# EAGLE design VC Panning Mixer main (EAGLE 7.7.0)
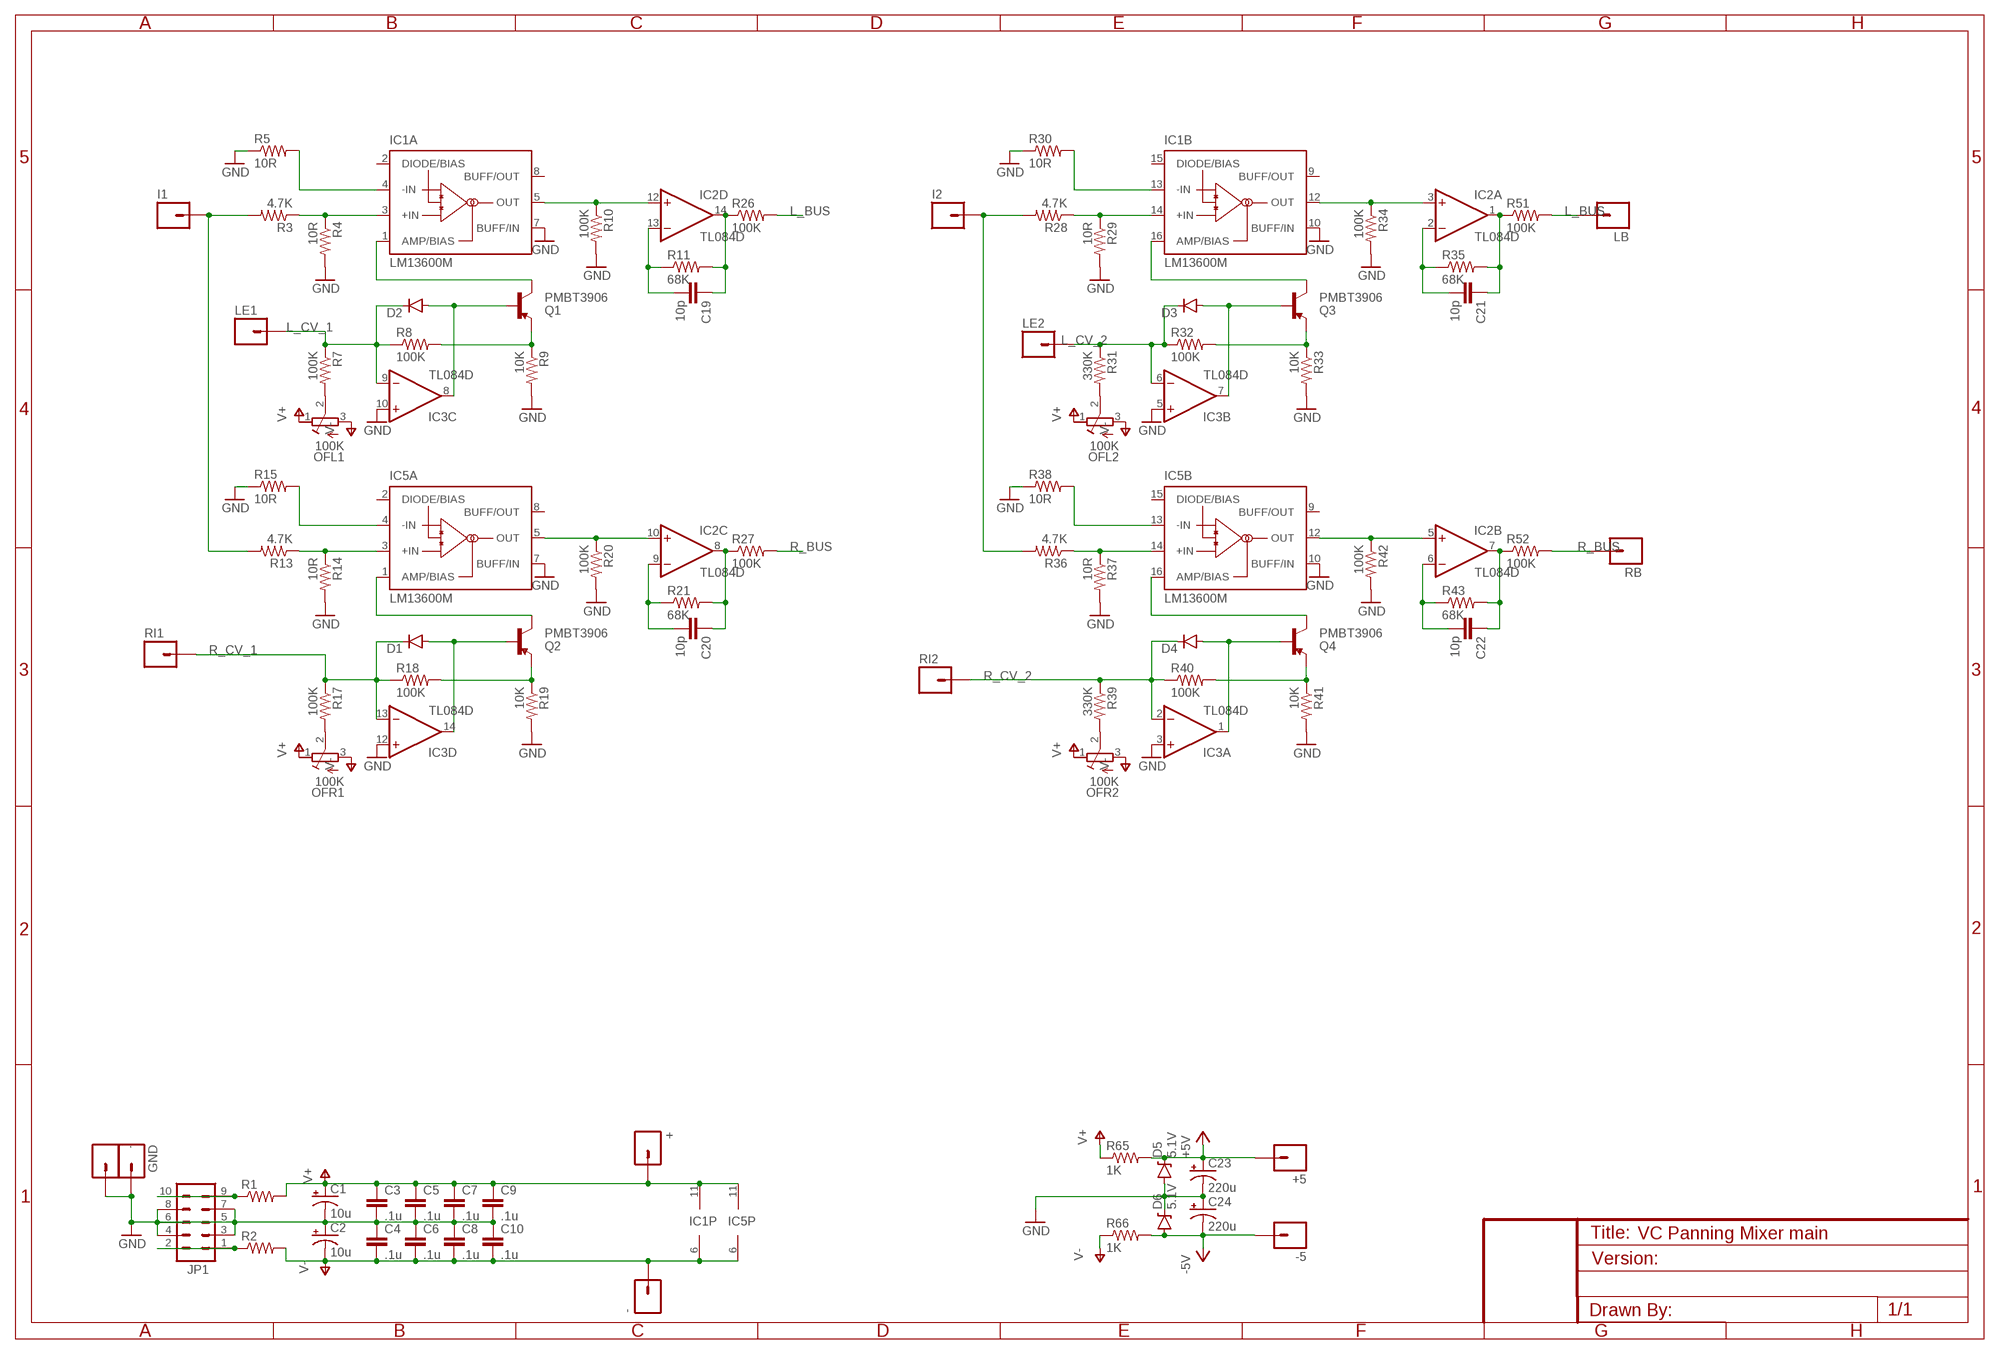
[diagram p0: schematic, sheet 1]

## Parts
+  M01PTH  [1X01]
+5  M01PTH  [1X01]
-  M01PTH  [1X01]
-5  M01PTH  [1X01]
.  M01PTH  [1X01]
C1  10u  CAP_POLPTH2  [CPOL-RADIAL-10UF-25V]
C2  10u  CAP_POLPTH2  [CPOL-RADIAL-10UF-25V]
C3  .1u  CAP0805  [0805]
C4  .1u  CAP0805  [0805]
C5  .1u  CAP0805  [0805]
C6  .1u  CAP0805  [0805]
C7  .1u  CAP0805  [0805]
C8  .1u  CAP0805  [0805]
C9  .1u  CAP0805  [0805]
C10  .1u  CAP0805  [0805]
C19  10p  CAP0805  [0805]
C20  10p  CAP0805  [0805]
C21  10p  CAP0805  [0805]
C22  10p  CAP0805  [0805]
C23  220u  CAP_POLPTH2  [CPOL-RADIAL-10UF-25V]
C24  220u  CAP_POLPTH2  [CPOL-RADIAL-10UF-25V]
D1  DIODESOD123  [SOD-123]
D2  DIODESOD123  [SOD-123]
D3  DIODESOD123  [SOD-123]
D4  DIODESOD123  [SOD-123]
D5  5.1V  DIODE-ZENER16V  [SOD-123]
D6  5.1V  DIODE-ZENER16V  [SOD-123]
GND  M01PTH  [1X01]
I1  M01PTH  [1X01]
I2  M01PTH  [1X01]
IC1  LM13600M  [SO16]
IC2  TL084D  [SO14]
IC3  TL084D  [SO14]
IC5  LM13600M  [SO16]
JP1  M05X2PTH  [AVR_ICSP]
LB  M01PTH  [1X01]
LE1  M01PTH  [1X01]
LE2  M01PTH  [1X01]
OFL1  100K  R-TRIMM3314G  [RTRIM3314G]
OFL2  100K  R-TRIMM3314G  [RTRIM3314G]
OFR1  100K  R-TRIMM3314G  [RTRIM3314G]
OFR2  100K  R-TRIMM3314G  [RTRIM3314G]
Q1  PMBT3906  TRANSISTOR_PNPPMBT3906  [SOT23-3]
Q2  PMBT3906  TRANSISTOR_PNPPMBT3906  [SOT23-3]
Q3  PMBT3906  TRANSISTOR_PNPPMBT3906  [SOT23-3]
Q4  PMBT3906  TRANSISTOR_PNPPMBT3906  [SOT23-3]
R1  RESISTOR0805-RES  [0805@1]
R2  RESISTOR0805-RES  [0805@1]
R3  4.7K  RESISTOR0805-RES  [0805]
R4  10R  RESISTOR0805-RES  [0805]
R5  10R  RESISTOR0805-RES  [0805]
R7  100K  RESISTOR0805-RES  [0805]
R8  100K  RESISTOR0805-RES  [0805]
R9  10K  RESISTOR0805-RES  [0805]
R10  100K  RESISTOR0805-RES  [0805]
R11  68K  RESISTOR0805-RES  [0805]
R13  4.7K  RESISTOR0805-RES  [0805]
R14  10R  RESISTOR0805-RES  [0805]
R15  10R  RESISTOR0805-RES  [0805]
R17  100K  RESISTOR0805-RES  [0805]
R18  100K  RESISTOR0805-RES  [0805]
R19  10K  RESISTOR0805-RES  [0805]
R20  100K  RESISTOR0805-RES  [0805]
R21  68K  RESISTOR0805-RES  [0805]
R26  100K  RESISTOR0805-RES  [0805]
R27  100K  RESISTOR0805-RES  [0805]
R28  4.7K  RESISTOR0805-RES  [0805]
R29  10R  RESISTOR0805-RES  [0805]
R30  10R  RESISTOR0805-RES  [0805]
R31  330K  RESISTOR0805-RES  [0805]
R32  100K  RESISTOR0805-RES  [0805]
R33  10K  RESISTOR0805-RES  [0805]
R34  100K  RESISTOR0805-RES  [0805]
R35  68K  RESISTOR0805-RES  [0805]
R36  4.7K  RESISTOR0805-RES  [0805]
R37  10R  RESISTOR0805-RES  [0805]
R38  10R  RESISTOR0805-RES  [0805]
R39  330K  RESISTOR0805-RES  [0805]
R40  100K  RESISTOR0805-RES  [0805]
R41  10K  RESISTOR0805-RES  [0805]
R42  100K  RESISTOR0805-RES  [0805]
R43  68K  RESISTOR0805-RES  [0805]
R51  100K  RESISTOR0805-RES  [0805]
R52  100K  RESISTOR0805-RES  [0805]
R65  1K  RESISTOR0805-RES  [0805]
R66  1K  RESISTOR0805-RES  [0805]
RB  M01PTH  [1X01]
RI1  M01PTH  [1X01]
RI2  M01PTH  [1X01]

## Nets
+5V: +5.1 C23.1(+) D5.C R65.2
-5V: -5.1 C24.2(-) D6.A R66.2
GND: ..1 C1.2(-) C2.1(+) C3.2 C4.1 C5.2 C6.1 C7.2 C8.1 C9.2 C10.1 C23.2(-) C24.1(+) D5.A D6.C GND.1 IC1.7(A:BUFF/IN) IC1.10(B:BUFF/IN) IC3.3(A:+IN) IC3.5(B:+IN) IC3.10(C:+IN) IC3.12(D:+IN) IC5.7(A:BUFF/IN) IC5.10(B:BUFF/IN) JP1.3 JP1.4 JP1.5 JP1.6 JP1.7 JP1.8 R4.2 R5.1 R9.2 R10.2 R14.2 R15.1 R19.2 R20.2 R29.2 R30.1 R33.2 R34.2 R37.2 R38.1 R41.2 R42.2
L_BUS: LB.1 R26.2 R51.2
L_CV_1: D2.C IC3.9(C:-IN) LE1.1 R7.1 R8.1
L_CV_2: D3.C IC3.6(B:-IN) LE2.1 R31.1 R32.1
N$1: JP1.9 JP1.10 R1.1
N$2: JP1.1 JP1.2 R2.1
N$3: I1.1 R3.2 R13.2
N$4: IC5.3(A:+IN) R13.1 R14.1
N$5: IC5.4(A:-IN) R15.2
N$6: OFR1.2(S) R17.2
N$8: Q2.2(E) R18.2 R19.1
N$9: D1.A IC3.14(D:OUT) Q2.1(B)
N$10: IC5.1(A:AMP/BIAS) Q2.3(C)
N$12: IC1.3(A:+IN) R3.1 R4.1
N$13: IC2.10(C:+IN) IC5.5(A:OUT) R20.1
N$14: IC1.4(A:-IN) R5.2
N$15: OFL1.2(S) R7.2
N$17: Q1.2(E) R8.2 R9.1
N$18: D2.A IC3.8(C:OUT) Q1.1(B)
N$20: C20.2 IC2.9(C:-IN) R21.1
N$21: IC1.1(A:AMP/BIAS) Q1.3(C)
N$22: IC1.5(A:OUT) IC2.12(D:+IN) R10.1
N$23: C19.2 IC2.13(D:-IN) R11.1
N$24: C19.1 IC2.14(D:OUT) R11.2 R26.1
N$25: C20.1 IC2.8(C:OUT) R21.2 R27.1
N$36: IC1.14(B:+IN) R28.1 R29.1
N$37: IC1.13(B:-IN) R30.2
N$38: OFL2.2(S) R31.2
N$39: Q3.2(E) R32.2 R33.1
N$40: D3.A IC3.7(B:OUT) Q3.1(B)
N$41: IC1.16(B:AMP/BIAS) Q3.3(C)
N$42: IC1.12(B:OUT) IC2.3(A:+IN) R34.1
N$43: C21.2 IC2.2(A:-IN) R35.1
N$44: C21.1 IC2.1(A:OUT) R35.2 R51.1
N$45: I2.1 R28.2 R36.2
N$46: IC5.14(B:+IN) R36.1 R37.1
N$47: IC5.13(B:-IN) R38.2
N$48: OFR2.2(S) R39.2
N$49: Q4.2(E) R40.2 R41.1
N$50: D4.A IC3.1(A:OUT) Q4.1(B)
N$51: IC5.16(B:AMP/BIAS) Q4.3(C)
N$52: IC2.5(B:+IN) IC5.12(B:OUT) R42.1
N$53: C22.2 IC2.6(B:-IN) R43.1
N$54: C22.1 IC2.7(B:OUT) R43.2 R52.1
R_BUS: R27.2 R52.2 RB.1
R_CV_1: D1.C IC3.13(D:-IN) R17.1 R18.1 RI1.1
R_CV_2: D4.C IC3.2(A:-IN) R39.1 R40.1 RI2.1
V+: +.1 C1.1(+) C3.1 C5.1 C7.1 C9.1 IC1.11(P:V+) IC5.11(P:V+) OFL1.1(E) OFL2.1(E) OFR1.1(E) OFR2.1(E) R1.2 R65.1
V-: -.1 C2.2(-) C4.2 C6.2 C8.2 C10.2 IC1.6(P:V-) IC5.6(P:V-) OFL1.3(A) OFL2.3(A) OFR1.3(A) OFR2.3(A) R2.2 R66.1
Unconnected: IC1.2(A:DIODE/BIAS) IC1.8(A:BUFF/OUT) IC1.9(B:BUFF/OUT) IC1.15(B:DIODE/BIAS) IC5.2(A:DIODE/BIAS) IC5.8(A:BUFF/OUT) IC5.9(B:BUFF/OUT) IC5.15(B:DIODE/BIAS)

## Power pins joined to a net without a drawn wire
V+: IC2.4(P:V+) IC3.4(P:V+)
V-: IC2.11(P:V-) IC3.11(P:V-)

## Library data of the parts
+ +5 - -5 . GND I1 I2 LB LE1 LE2 RB RI1 RI2 = SparkFun-Connectors:M01: Header 1 Standard 1-pin 0.1" header. Use with straight break away headers (SKU : PRT-00116), right angle break away headers (PRT-00553), swiss pins (PRT-00743), machine pins (PRT-00117), and female headers (PRT-00115).
C1 C2 C23 C24 = SparkFun-Capacitors:CAP_POL: Capacitor Polarized These are standard SMD and PTH capacitors. Normally 10uF, 47uF, and 100uF in electrolytic and tantalum varieties. Always verify the external diameter of the through hole cap, it varies with capacity, voltage, and manufacturer. The EIA devices should be standard.
C3-C10 C19-C22 = SparkFun-Capacitors:CAP: Capacitor Standard 0603 ceramic capacitor, and 0.1" leaded capacitor.
D1-D4 = SparkFun-DiscreteSemi:DIODE: Diode These are standard reverse protection diodes and small signal diodes. SMA package can handle up to about 1A. SOD-323 can handle about 200mA. What the SOD-323 package when ordering, there are some mfgs out there that are 5-pin packages.
D5 D6 = SparkFun-DiscreteSemi:DIODE-ZENER: Zener Diode Production Part - 8199 3.4V Zener Voltage; PROD_ID: DIO-12440; VALUE: 16V
IC1 IC5 = national-semiconductor:LM13600: Dual Operational Transconductance Amplifiers with Linearizing Diodes and Buffers Source: lm13600.PDF
IC2 IC3 = linear:TL084: OP AMP
JP1 = SparkFun-Connectors:M05X2: Header 5x2 Standard 10-pin dual row 0.1" header. Commonly used with AVR-ISP. Use with Spark Fun Electronics SKU: PRT-00778
OFL1 OFL2 OFR1 OFR2 = rcl:R-TRIMM: Trimm resistor
Q1-Q4 = SparkFun-DiscreteSemi:TRANSISTOR_PNP: Generic PNP BJT Double check pinouts against datasheets- not all devices are the same! MMBT3906 - 40V 200mA SOT-23 (TRANS-08052) MMBT4403 - 40V 600mA SOT-23 (TRANS-09245); PROD_ID: TRANS-08052
R1 R2 = SparkFun-Passives:RESISTOR: Resistor Basic schematic elements and footprints for 0603, 1206, and PTH resistors.
R3-R5 R7-R11 R13-R15 R17-R21 R26-R43 R51 R52 R65 R66 = SparkFun-Resistors:RESISTOR: Resistor Basic schematic elements and footprints for 0603, 1206, and PTH resistors.

## Board
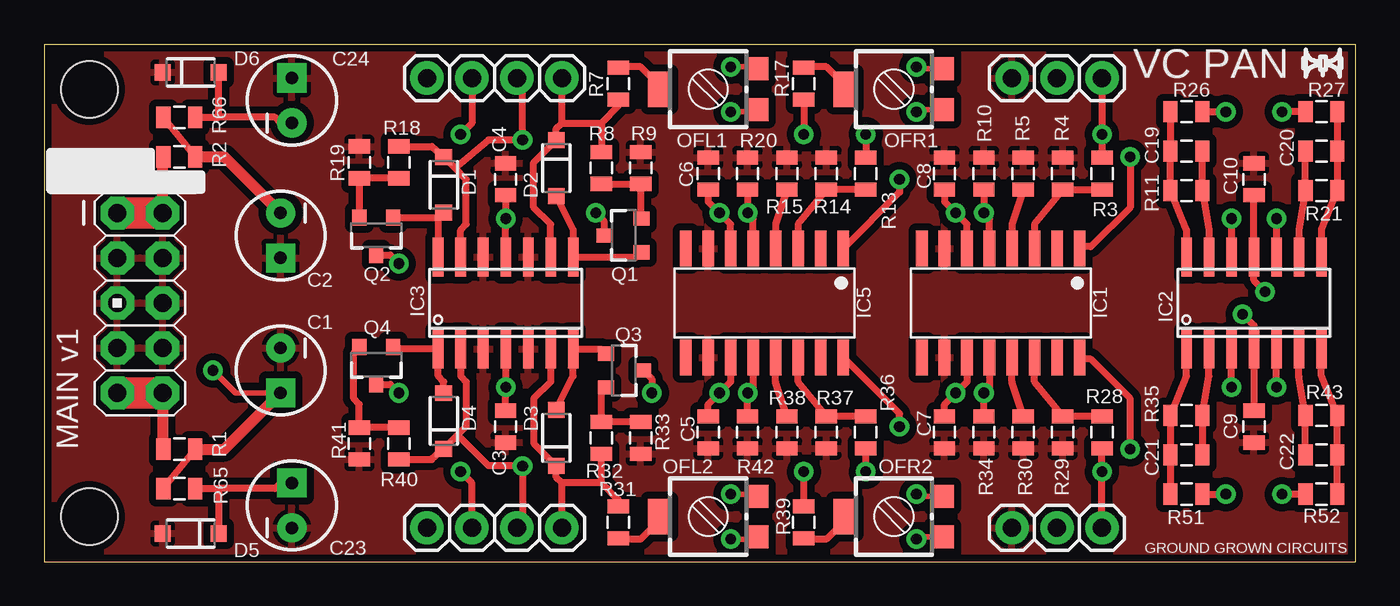
[diagram p1: board, top side]
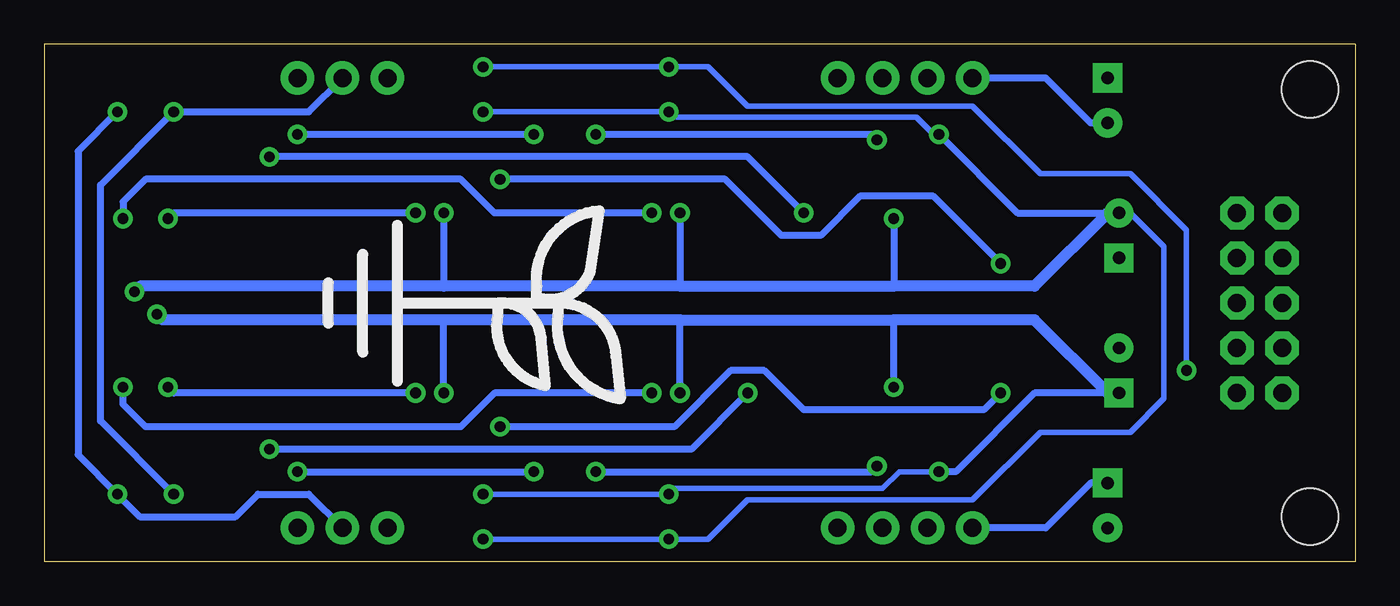
[diagram p2: board, bottom side, seen from below]

Size 73.98 x 29.21 mm. Coordinates in mm from the lower left corner, seen from the top.
Outline: 0,0 73.98,0 73.98,29.21 0,29.21 0,0
Copper layers (1*16): Top 0.035mm / dielectric 1.5mm / Bottom 0.035mm
Design rules "SparkFun": minimum track width 8mil, minimum drill 20mil, track to track 8mil, track to pad 8mil, pad to pad 8mil, via to via 8mil, smd to smd 8mil, copper to edge 8mil, drill to drill 8mil, minimum pad ring 12mil, minimum via ring 10mil, stop-mask expansion 4mil, vias tented up to drill 20mil, thermal gap 10mil
Holes 3.2 mm at 2.54,2.54 2.54,26.67

### Footprints (pad centres in the part's own frame; a part is rotated, then mirrored left to right if it is on the bottom)
1X01 = drill 1.016 pad 1.88: 1 0,0
CPOL-RADIAL-10UF-25V = drill 0.7 pad 1.651 square: 1 1.27,0 | drill 0.7 pad 1.651: 2 -1.27,0
0805 = smd 0.8 x 1.2: 1 -0.9,0; 2 0.9,0
SOD-123 = smd 0.9 x 0.95: A 1.575,0; C -1.575,0
SO16 = smd 0.66 x 2.032: 1 -4.445,-3.073; 2 -3.175,-3.073; 3 -1.905,-3.073; 4 -0.635,-3.073; 5 0.635,-3.073; 6 1.905,-3.073; 7 3.175,-3.073; 8 4.445,-3.073; 9 4.445,3.073; 10 3.175,3.073; 11 1.905,3.073; 12 0.635,3.073; 13 -0.635,3.073; 14 -1.905,3.073; 15 -3.175,3.073; 16 -4.445,3.073
SO14 = smd 0.6 x 2.2: 1 -3.81,-2.6; 2 -2.54,-2.6; 3 -1.27,-2.6; 4 0,-2.6; 5 1.27,-2.6; 6 2.54,-2.6; 7 3.81,-2.6; 8 3.81,2.6; 9 2.54,2.6; 10 1.27,2.6; 11 0,2.6; 12 -1.27,2.6; 13 -2.54,2.6; 14 -3.81,2.6
AVR_ICSP = drill 1.016 pad 1.88 octagon: 1 -1.27,5.08; 2 1.27,5.08; 3 -1.27,2.54; 4 1.27,2.54; 5 -1.27,0; 6 1.27,0; 7 -1.27,-2.54; 8 1.27,-2.54; 9 -1.27,-5.08; 10 1.27,-5.08
RTRIM3314G = smd 1.3 x 1.3: 1 1.15,-2.75; 3 -1.15,-2.75 | smd 2 x 1.3: 2 0,2.75
SOT23-3 = smd 0.8 x 0.9: 1 -0.95,-1; 2 0.95,-1; 3 0,1.1
0805@1 = smd 0.8 x 1.2: 1 -0.9,0; 2 0.9,0

### Placement (x,y rotation side)
+  24.13,1.91 0 top
+5  21.59,1.91 0 top
-  24.13,27.3 180 top
-5  21.59,27.3 180 top
.  54.61,27.3 180 top
C1  13.34,10.79 270 top
C2  13.34,18.41 270 top
C3  26.04,7.62 270 top
C4  26.04,21.59 270 top
C5  37.47,7.3 270 top
C6  37.47,21.91 270 top
C7  50.8,7.3 270 top
C8  50.8,21.91 270 top
C9  68.26,7.62 270 top
C10  68.26,21.59 270 top
C19  64.45,23.18 0 top
C20  72.07,23.18 180 top
C21  64.45,6.03 0 top
C22  72.07,6.03 180 top
C23  13.97,3.17 90 top
C24  13.97,26.04 90 top
D1  22.54,21.27 270 top
D2  28.89,22.23 270 top
D3  28.89,6.99 90 top
D4  22.54,7.94 90 top
D5  8.26,1.59 180 top
D6  8.26,27.62 0 top
GND  54.61,1.91 0 top
I1  59.69,27.3 180 top
I2  59.69,1.91 0 top
IC1  53.98,14.61 180 top
IC2  68.26,14.61 0 top
IC3  26.04,14.61 0 top
IC5  40.64,14.61 180 top
JP1  5.4,14.61 0 top
LB  57.15,27.3 180 top
LE1  29.21,27.3 180 top
LE2  29.21,1.91 0 top
OFL1  37.47,26.67 90 top
OFL2  37.47,2.54 90 top
OFR1  47.94,26.67 90 top
OFR2  47.94,2.54 90 top
Q1  32.7,18.41 90 top
Q2  18.73,18.41 180 top
Q3  32.7,10.79 270 top
Q4  18.73,11.11 180 top
R1  7.62,6.35 0 top
R2  7.62,22.86 0 top
R3  59.69,21.91 90 top
R4  57.47,21.91 90 top
R5  55.24,21.91 270 top
R7  32.38,26.99 90 top
R8  31.43,22.23 270 top
R9  33.66,22.23 90 top
R10  53.02,21.91 90 top
R11  64.45,20.95 180 top
R13  46.35,21.91 90 top
R14  44.13,21.91 90 top
R15  41.91,21.91 270 top
R17  42.86,26.99 90 top
R18  20,22.54 270 top
R19  17.78,22.54 90 top
R20  39.69,21.91 90 top
R21  72.07,20.95 0 top
R26  64.45,25.4 0 top
R27  72.07,25.4 180 top
R28  59.69,7.3 270 top
R29  57.47,7.3 270 top
R30  55.24,7.3 90 top
R31  32.38,2.22 270 top
R32  31.43,6.99 90 top
R33  33.66,6.99 270 top
R34  53.02,7.3 270 top
R35  64.45,8.26 180 top
R36  46.35,7.3 270 top
R37  44.13,7.3 270 top
R38  41.91,7.3 90 top
R39  42.86,2.22 270 top
R40  20,6.67 90 top
R41  17.78,6.67 270 top
R42  39.69,7.3 270 top
R43  72.07,8.26 0 top
R51  64.45,3.81 0 top
R52  72.07,3.81 180 top
R65  7.62,4.13 0 top
R66  7.62,25.08 0 top
RB  57.15,1.91 0 top
RI1  26.67,27.3 180 top
RI2  26.67,1.91 0 top
U$1  [LOGO_LARGE]  53.98,14.61 270 bottom

### Tracks (layer width: path | path; a pad name or v marks a point on that pad's centre or on a via)
+5V
  Top 0.406: R65.2 9.84,4.13 | 9.84,4.13 9.84,1.6 D5.C | C23.1 13.34,4.45 13.02,4.13 9.84,4.13
  Bottom 0.406: C23.1 14.92,4.45 17.46,1.91 +5.1
-5V
  Top 0.406: R66.2 9.84,25.08 | 9.84,25.08 9.84,27.61 D6.A | C24.2 13.34,24.77 13.02,25.08 9.84,25.08
  Bottom 0.406: C24.2 14.92,24.77 17.46,27.3 -5.1
GND
  pour Top (isolate 0.406): 0,0 73.98,0 73.98,29.21 0,29.21
L_BUS  (via drill 0.6)
  Top 0.406: R51.2 v66.67,3.81 | R26.2 v66.67,25.4
  Bottom 0.406: v66.67,3.81 70.8,7.94 70.8,21.27 v66.67,25.4 59.05,25.4 LB.1
L_CV_1
  Top 0.406: 29.21,24.77 28.89,24.45 D2.C 27.62,22.53 27.62,20 28.57,19.05 IC3.9 | 29.21,24.77 LE1.1 | R7.1 32.38,25.72 31.43,24.77 | 31.43,24.77 R8.1 | 29.21,24.77 31.43,24.77
L_CV_2
  Top 0.406: LE2.1 29.21,4.45 | 29.21,4.45 28.89,4.76 D3.C 27.62,6.68 27.62,9.21 28.57,10.16 IC3.6 | R31.1 32.38,3.49 31.43,4.45 | 31.43,4.45 29.21,4.45 | 31.43,4.45 R32.1
N$1
  Top 0.61: JP1.10 6.67,6.4 R1.1
  Top 1.778: JP1.9 JP1.10
N$2
  Top 0.61: JP1.2 6.67,22.81 R2.1
  Top 1.778: JP1.1 JP1.2
N$3  (via drill 0.6)
  Top 0.406: I1.1 v59.69,24.13 R3.2 | v46.35,24.13 R13.2
  Bottom 0.406: v59.69,24.13 v46.35,24.13
N$4
  Top 0.406: R13.1 R14.1 42.55,19.05 IC5.3
N$5
  Top 0.406: R15.2 41.27,19.05 IC5.4
N$6
  Top 0.406: OFR1.2 45.19,26.88 44.13,27.94 42.91,27.94 R17.2
N$8
  Top 0.406: R18.2 R19.1 Q2.2
N$9
  Top 0.406: IC3.14 22.23,19.38 D1.A 22.26,19.41 Q2.1
N$10  (via drill 0.6)
  Top 0.406: Q2.3 19.52,17.32 v20,16.83 | v48.26,21.59 48.26,20.85 IC5.1
  Bottom 0.406: v20,16.83 23.81,20.64 27.94,20.64 30.16,18.41 32.38,18.41 35.56,21.59 v48.26,21.59
N$12
  Top 0.406: IC1.3 55.88,19.05 R4.1 R3.1
N$13  (via drill 0.6)
  Top 0.406: IC5.5 40.01,19.37 v39.69,19.68 R20.1 | v69.53,19.37 IC2.10
  Bottom 0.406: v39.69,19.68 48.58,19.68 50.48,21.59 68.26,21.59 69.53,20.32 v69.53,19.37
N$14
  Top 0.406: R5.2 54.61,19.05 IC1.4
N$15
  Top 0.406: OFL1.2 34.72,26.88 33.66,27.94 32.44,27.94 R7.2
N$17
  Top 0.406: R8.2 R9.1 33.66,19.41 Q1.2
N$18
  Top 0.406: D2.A 29.84,18.73 IC3.8 33.44,17.2 Q1.1
N$20
  Top 0.406: C20.2 R21.1 70.8,18.73 IC2.9
N$21  (via drill 0.6)
  Top 0.406: Q1.3 31.6,19.2 v31.11,19.68 | v61.28,22.86 61.28,20 59.05,17.78 58.52,17.78 IC1.1
  Bottom 0.406: v31.11,19.68 34.29,22.86 v61.28,22.86
N$22  (via drill 0.6)
  Top 0.406: IC1.5 53.34,19.37 v53.02,19.68 R10.1 | v66.99,19.37 IC2.12
  Bottom 0.406: v53.02,19.68 66.67,19.68 v66.99,19.37
N$23
  Top 0.406: IC2.13 65.72,18.73 R11.1 C19.2
N$24
  Top 0.406: IC2.14 64.45,18.73 R11.2 C19.1 R26.1
N$25
  Top 0.406: R27.1 C20.1 R21.2 72.07,18.73 IC2.8
N$36
  Top 0.406: R28.1 R29.1 55.88,10.16 IC1.14
N$37
  Top 0.406: R30.2 54.61,10.16 IC1.13
N$38
  Top 0.406: OFL2.2 34.72,2.33 33.66,1.27 32.44,1.27 R31.2
N$39
  Top 0.406: R33.1 R32.2 31.43,9.57 Q3.2 31.75,9.8
N$40
  Top 0.406: Q3.1 31.44,12.01 IC3.7 29.84,10.48 D3.A
N$41  (via drill 0.6)
  Top 0.406: Q3.3 34.29,10.31 v34.29,9.53 | v61.28,6.35 61.28,9.21 59.05,11.43 58.52,11.43 IC1.16
  Bottom 0.406: v34.29,9.53 37.47,6.35 v61.28,6.35
N$42  (via drill 0.6)
  Top 0.406: IC1.12 53.34,9.84 v53.02,9.53 R34.1 | v66.99,9.84 IC2.3
  Bottom 0.406: v53.02,9.53 66.67,9.53 v66.99,9.84
N$43
  Top 0.406: IC2.2 65.72,10.48 R35.1 C21.2
N$44
  Top 0.406: IC2.1 64.45,10.48 R35.2 C21.1 R51.1
N$45  (via drill 0.6)
  Top 0.406: I2.1 v59.69,5.08 R28.2 | v46.35,5.08 R36.2
  Bottom 0.406: v59.69,5.08 v46.35,5.08
N$46
  Top 0.406: R36.1 R37.1 42.55,10.16 IC5.14
N$47
  Top 0.406: R38.2 41.27,10.16 IC5.13
N$48
  Top 0.406: OFR2.2 45.19,2.33 44.13,1.27 42.91,1.27 R39.2
N$49
  Top 0.406: R40.2 R41.1 17.78,8.89 17.46,9.21 17.46,11.79 Q4.2
N$50
  Top 0.406: Q4.1 19.79,12.01 IC3.1 22.23,10.48 22.54,10.16 D4.A
N$51  (via drill 0.6)
  Top 0.406: Q4.3 19.52,10.01 v20,9.53 | v48.26,7.62 48.26,8.36 IC5.16
  Bottom 0.406: v20,9.53 20.95,8.57 31.11,8.57 33.34,10.79 35.24,10.79 38.42,7.62 v48.26,7.62
N$52  (via drill 0.6)
  Top 0.406: IC5.12 40.01,9.84 v39.69,9.53 R42.1 | v69.53,9.84 IC2.5
  Bottom 0.406: v39.69,9.53 48.58,9.53 50.48,7.62 68.26,7.62 69.53,8.89 v69.53,9.84
N$53
  Top 0.406: C22.2 R43.1 70.8,10.48 IC2.6
N$54
  Top 0.406: IC2.7 72.07,10.48 R43.2 C22.1 R52.1
R_BUS  (via drill 0.6)
  Top 0.406: R27.2 v69.85,25.4 | R52.2 v69.85,3.81
  Bottom 0.406: v69.85,25.4 72.07,23.18 72.07,6.03 v69.85,3.81 68.58,2.54 63.18,2.54 61.91,3.81 59.05,3.81 RB.1
R_CV_1  (via drill 0.6)
  Top 0.406: R18.1 21.87,23.44 D1.C 23.17,22.22 | IC3.13 23.5,18.73 23.81,19.05 23.81,21.58 23.17,22.22 | R17.1 v42.86,24.13 | RI1.1 26.99,26.99 v26.99,23.81 26.98,23.8 25.07,23.8 23.17,22.22
  Bottom 0.406: v42.86,24.13 27.3,24.13 v26.99,23.81
R_CV_2  (via drill 0.6)
  Top 0.406: R40.1 21.87,5.77 D4.C 23.33,7.15 | IC3.2 23.5,10.48 23.81,10.16 23.81,7.63 23.33,7.15 | R39.1 v42.86,5.08 | RI2.1 26.99,2.22 v26.99,5.4 26.98,5.41 25.07,5.41 23.33,7.15
  Bottom 0.406: v42.86,5.08 27.3,5.08 v26.99,5.4
V+  (via drill 0.6)
  Top 0.305: v38.73,3.81 40.09,3.81 OFL2.1 | OFR2.1 49.33,3.69 v49.21,3.81 | OFR1.1 49.33,27.82 v49.21,27.94 | v38.73,27.94 40.09,27.94 OFL1.1 | C1.1 10.79,9.53 v9.53,10.79
  Top 0.406: C3.1 v26.04,9.84 IC3.4 | IC5.11 38.73,10.16 v38.1,9.53 37.47,8.89 C5.1 | v67.63,13.97 68.26,13.34 IC2.4 C9.1 | IC1.11 52.07,10.16 v51.44,9.53 50.8,8.89 C7.1 | +.1 24.13,4.45 v23.5,5.08 | R1.2 R65.1
  Top 0.61: R1.2 10.16,6.35 C1.1
  Bottom 0.305: v23.5,5.08 25.72,5.08 26.67,4.13 38.42,4.13 v38.73,3.81 v49.21,3.81 | v49.21,27.94 v38.73,27.94 36.51,27.94 34.29,25.72 21.59,25.72 17.78,21.91 12.7,21.91 9.53,18.73 v9.53,10.79
  Bottom 0.406: v26.04,9.84 26.04,13.65 | v38.1,9.53 38.1,13.65 | v51.44,9.53 51.44,13.65 | C1.1 18.1,9.53 22.54,5.08 v23.5,5.08
  Bottom 0.61: C1.1 13.97,9.53 18.1,13.65 26.04,13.65 38.1,13.65 51.44,13.65 67.31,13.65 v67.63,13.97
V-  (via drill 0.6)
  Top 0.305: OFR2.3 49.33,1.39 v49.21,1.27 | v38.73,1.27 40.09,1.27 | OFR1.3 49.33,25.52 v49.21,25.4 | v38.73,25.4 40.09,25.4 OFL1.3
  Top 0.406: C4.2 v26.04,19.37 IC3.11 | IC5.6 38.73,19.05 v38.1,19.68 37.47,20.32 C6.2 | v68.9,15.24 68.26,15.88 IC2.11 C10.2 | IC1.6 52.07,19.05 v51.44,19.68 50.8,20.32 C8.2 | 40.09,1.27 OFL2.3 | -.1 24.13,24.77 v23.5,24.13 | R2.2 R66.1
  Top 0.61: R2.2 10.16,22.86 C2.2
  Bottom 0.305: v49.21,1.27 v38.73,1.27 36.51,1.27 34.29,3.49 21.59,3.49 17.78,7.3 12.7,7.3 10.79,9.21 10.79,17.78 12.7,19.68 C2.2 | v49.21,25.4 v38.73,25.4 38.42,25.08 24.77,25.08 23.81,24.13 v23.5,24.13
  Bottom 0.406: v26.04,19.37 26.04,15.56 | v38.1,19.68 38.1,15.56 | v51.44,19.68 51.44,15.56 | v23.5,24.13 19.05,19.68 C2.2
  Bottom 0.61: C2.2 13.97,19.68 18.1,15.56 26.04,15.56 38.1,15.56 51.44,15.56 68.58,15.56 v68.9,15.24

### Text on the board
tPlace: VC PAN | MAIN v1 | GROUND GROWN CIRCUITS